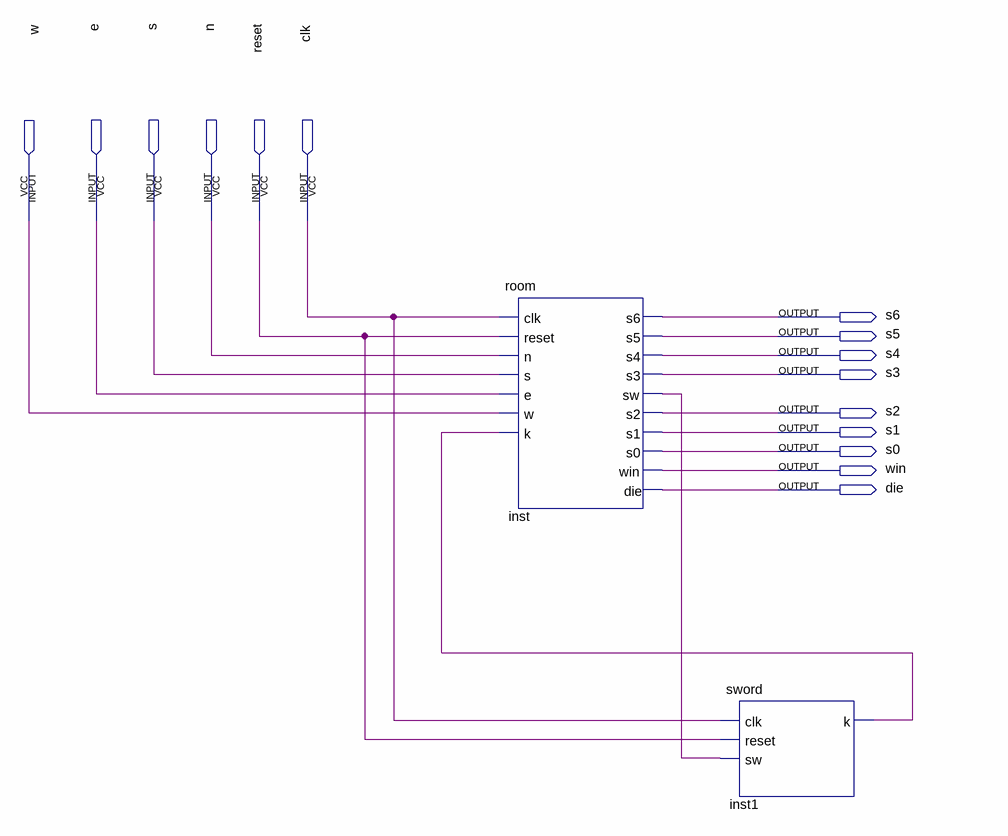
[diagram p0: schematic sheet]
// Quartus schematic game.bdf as structural Verilog: 2 symbols, 15 pins
module game (
  input  w,
  input  e,
  input  s,
  input  n,
  input  reset,
  input  clk,
  output s6,
  output s5,
  output s4,
  output s3,
  output s2,
  output s1,
  output s0,
  output win,
  output die
);

  wire inst1_k, inst_sw;

  room inst (
    .clk(clk), .reset(reset), .n(n), .s(s), .e(e), .w(w), .k(inst1_k), .s6(s6), .s5(s5), .s4(s4), .s3(s3),
    .sw(inst_sw), .s2(s2), .s1(s1), .s0(s0), .win(win), .die(die));
  sword inst1 (.clk(clk), .reset(reset), .sw(inst_sw), .k(inst1_k));
endmodule
